# Altium schematic sheet inputs.SchDoc: Input
size Letter; Organization: NewAE Technology Inc.; Address1: 1083 Queen St., Suite 196; Address2: Halifax; Address3: NS; Address4: Canada B3H 0B2; SheetApproved: NO
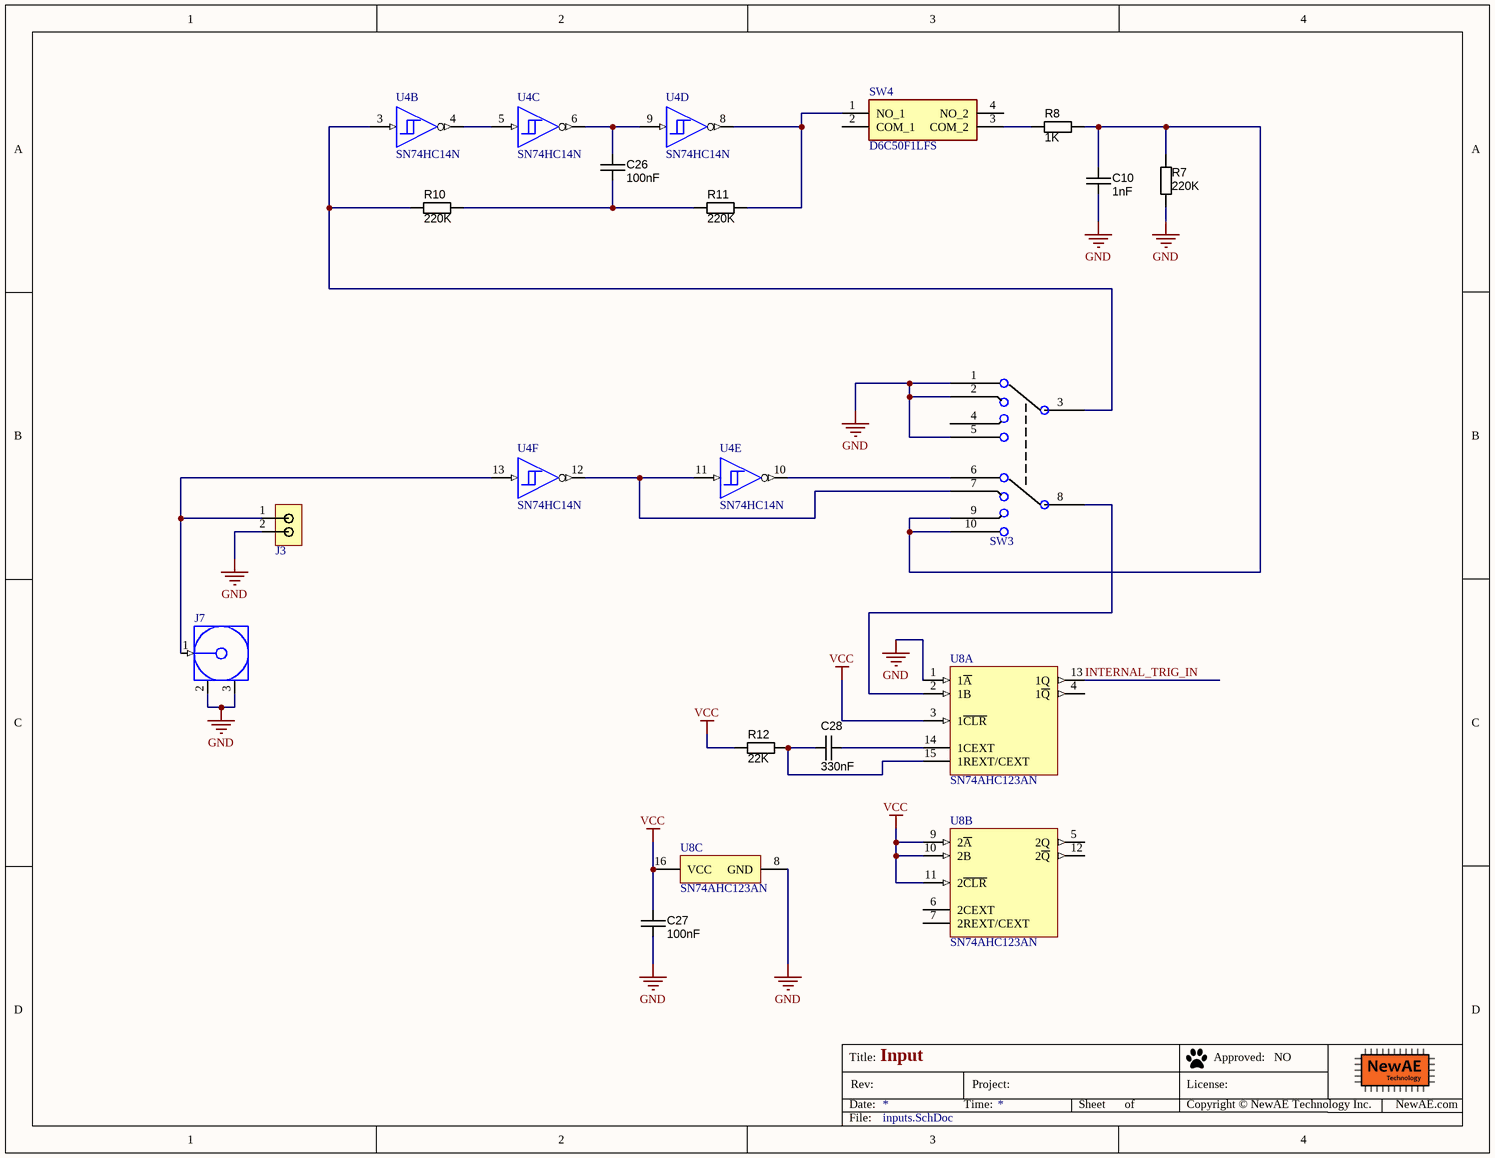
[diagram p0: inputs.SchDoc]

## Parts
C10  value 1nF  [CAPC500P450250X550]  (hidden comment: approved sub OK)
C26  value 100nF  [CAPC500P450250X550]  (hidden comment: approved sub OK)
C27  value 100nF  [CAPC500P450250X550]  (hidden comment: approved sub OK)
C28  value 330nF  [CAPC500P450250X550]  (hidden comment: approved sub OK)
J3  Jumper  [2x2.54mm_Header]  (value not drawn)
J7  73171-3150  [73171-3150]  (value not drawn)
R7  value 220K  [RESTH_AXIAL-0.4]  (hidden comment: Carbon Film)
R8  value 1K  [RESTH_AXIAL-0.4]  (hidden comment: Carbon Film)
R10  value 220K  [RESTH_AXIAL-0.4]  (hidden comment: Carbon Film)
R11  value 220K  [RESTH_AXIAL-0.4]  (hidden comment: Carbon Film)
R12  value 22K  [RESTH_AXIAL-0.4]  (hidden comment: Carbon Film)
SW3  SS-24E06-TG 5 (P)  [CK_SS24E06TG5P]  (value not drawn)
SW4  D6C50F1LFS  [D6C50F1LFS]
U4  SN74HC14N  [N0014A]  (parts B,C,D,E,F of 7)
U8  SN74AHC123AN  [N0016A]  (parts A,B,C of 3)

## Nets
GND: C10.1 C27.2 J3.2 J7.2(GND) J7.3(GND) R7.1 SW3.1 SW3.2 SW3.5 U8.1(1~{A}) U8.8(GND)
VCC: C27.1 R12.2 U8.3(1~{CLR}) U8.9(2~{A}) U8.10(2B) U8.11(2~{CLR}) U8.16(VCC)
INTERNAL_TRIG_IN: U8.13(1Q)
NetC10_2: C10.2 R7.2 R8.2 SW3.9 SW3.10
NetC26_1: C26.1 U4.6(~{3Y}) U4.9(4A)
NetC26_2: C26.2 R10.1 R11.2
NetC28_1: C28.1 R12.1 U8.15(1REXT/CEXT)
NetC28_2: C28.2 U8.14(1CEXT)
NetJ3_1: J3.1 J7.1(Signal) U4.13(6A)
NetR8_1: R8.1 SW4.3(COM_2)
NetR10_2: R10.2 SW3.3 U4.3(2A)
NetR11_1: R11.1 SW4.1(NO_1) U4.8(~{4Y})
NetSW3_6: SW3.6 U4.10(~{5Y})
NetSW3_7: SW3.7 U4.11(5A) U4.12(~{6Y})
NetSW3_8: SW3.8 U8.2(1B)
NetU4_4: U4.4(~{2Y}) U4.5(3A)

Not connected (* = marked no-connect by the designer): SW3 4; SW4 2(COM_1) 4(NO_2); U8 4(1~{Q}) 5(2Q) 6(2CEXT) 7(2REXT/CEXT) 12(2~{Q})

## Notes on the sheet
- Title:
- Date:
- Rev:
- Time:
- Project:
- Sheet
- of
- License:
- Copyright © NewAE Technology Inc.
- Approved:
- NewAE.com
- File:

## Library data of the parts
C10 C26-C28 = CAPR_220n_Radial_5mm: Capacitor Ceramic 220nF 10% 50V X7R radial 5mm lead spacing; Manufacturer 1: TDK Corporation; Ratings: 50V; X7R; SCDType: spec; Tolerance: ±10%; Material: ceramic; Supplier 1: Digi-Key; Package / Case: 0.217" L x 0.177" W (5.50mm x 4.50mm) radial 5mm LS; Operating Temperature: -55°C ~ 125°C; ComponentLink1URL: http://www.tdk.co.jp/tefe02/e4941_fk.pdf; ComponentLink1Description: e4941_fk datasheet
J3 = 2_PIN_JUMPER: 1x2 2.54mm header, male pins; Manufacture 1: Harwin; Manufacture Part Number 1: M20-9990246; Component Group: PCB Feature; PP Material Stack: 0; Part Number: 2_PIN_JUMPER; Pin Count: 2; Supplier 1: Digi-Key; Supplier Part Number 1: 952-2262-ND; Mounting Technology: Through-hole; RoHS: Yes; Component Kind: Standard; Component Type: Standard; PP Rotation: 0
J7 = CON-BNC-CHEAP: Molex Cheap R/A BNC; Component Group: Connector; PP Material Stack: 0; Part Number: CON-BNC-CHEAP; Manufacture 1: Molex; Manufacture Part Number 1: 73171-3150; Pin Count: 3; Supplier 1: Digi-Key; Component Kind: Standard; Component Type: Standard; PP Rotation: 0
R7 R8 R10-R12 = RES_220R_Axial_0.25W_5%: Resistor THD Axial 220 Ohm 0.25W 5% Carbon Film; Manufacturer 1: Yageo; Manufacturer Part Number 1: CFR-25JB-220R; Ratings: 1/4W; SCDType: spec; Tolerance: ±5%; Package / Case: Axial; Supplier 1: Digi-Key; Supplier Part Number 1: 220QBK-ND
SW3 = SS24E06TG5P: 2P4T Slide, C&K Through Hole; Manufacture 1: C&K Components; Component Group: Switch; PP Material Stack: 0; Part Number: SS24E06TG5P; Manufacture Part Number 1: SS-24E06-TG 5 (P); Pin Count: 10; Supplier 1: Digi-Key; Supplier Part Number 1: CKN10394-ND; Component Kind: Standard; Component Type: Standard; PP Rotation: 0
SW4 = D6C50F1LFS: Switch; Manufacturer_Name: C & K COMPONENTS; Datasheet Link: https://componentsearchengine.com/Datasheets/1/D6C50F1LFS.pdf; Height: 9.8mm; Manufacturer_Part_Number: D6C50F1LFS; Mouser Part Number: 611-D6C50F1LFS; Mouser Price/Stock: https://www.mouser.com/Search/Refine.aspx?Keyword=611-D6C50F1LFS
U4 = CMP-1615-00889-3: Hex Schmitt-Trigger Inverters, N0014A, TUBE; Manufacturer: Texas Instruments; Input Type: CMOS; Voltage(Nom)(V): 5; VCC(Min)(V): 2; tpd @ Nom Voltage(Max)(ns): 31; Technology Family: HC; VCC(Max)(V): 6; F @ Nom Voltage(Max)(Mhz): 20; Output Drive (IOL/IOH)(Max)(mA): -4/4; Rating: Catalog; Schmitt Trigger: Yes; ICC @ Nom Voltage(Max)(mA): 0.02; PackageReference: N0014A; Code_JEDEC: MS-001; Operating Temperature Range(C): -40 to 85; Generic Part Number: SN74HC14; Bits(#): 6; DatasheetVersion: SCLS085G; Output Type: CMOS
U8 = CMP-1629-00116-2: Dual Retriggerable Monostable Multivibrators, N0016A, TUBE; Manufacturer: Texas Instruments; F @ Nom Voltage(Max)(Mhz): 110; Input Type: LVTTL/CMOS; Output Type: CMOS; VCC(Max)(V): 5.5; VCC(Min)(V): 2; Voltage(Nom)(V): 3.3,5; Rating: Catalog; tpd @ Nom Voltage(Max)(ns): 29.5,17; Technology Family: AHC; Schmitt Trigger: No; ICC @ Nom Voltage(Max)(mA): 0.04; Output Drive (IOL/IOH)(Max)(mA): 50/-50; PackageReference: N0016A; Bits(#): 2; Operating Temperature Range(C): -40 to 85; Generic Part Number: SN74AHC123A; Code_JEDEC: MS-001; DatasheetVersion: SCLS352H